# EAGLE design mm5823 (EAGLE 7.1.0)
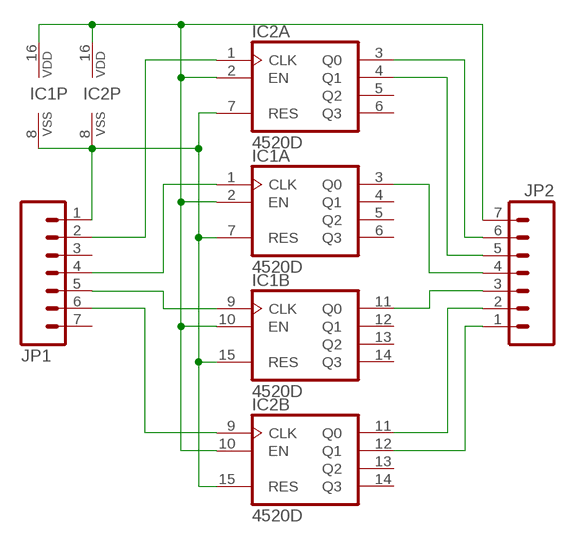
[diagram p0: schematic, sheet 1]

## Parts
IC1  4520D  [SO16]
IC2  4520D  [SO16]
JP1  M07  [1X07]
JP2  M07  [1X07]

## Nets
N$1: IC2.3(A:Q0) JP2.6
N$2: IC2.4(A:Q1) JP2.5
N$3: IC2.12(B:Q1) JP2.1
N$4: IC2.11(B:Q0) JP2.2
N$5: IC2.1(A:CLK) JP1.2
N$6: IC2.9(B:CLK) JP1.6
N$7: IC1.3(A:Q0) JP2.4
N$8: IC1.11(B:Q0) JP2.3
N$9: IC1.1(A:CLK) JP1.4
N$10: IC1.9(B:CLK) JP1.5
N$11: IC1.7(A:RES) IC1.8(P:VSS) IC1.15(B:RES) IC2.7(A:RES) IC2.8(P:VSS) IC2.15(B:RES) JP1.1
N$13: IC1.2(A:EN) IC1.10(B:EN) IC1.16(P:VDD) IC2.2(A:EN) IC2.10(B:EN) IC2.16(P:VDD) JP2.7
Unconnected: IC1.4(A:Q1) IC1.5(A:Q2) IC1.6(A:Q3) IC1.12(B:Q1) IC1.13(B:Q2) IC1.14(B:Q3) IC2.5(A:Q2) IC2.6(A:Q3) IC2.13(B:Q2) IC2.14(B:Q3) JP1.3 JP1.7

## Library data of the parts
IC1 IC2 = 45xx:4520: Dual binary up COUNTER
JP1 JP2 = SparkFun-Connectors:M07: Header 7 Standard 7-pin 0.1" header. Use with straight break away headers (SKU : PRT-00116), right angle break away headers (PRT-00553), swiss pins (PRT-00743), machine pins (PRT-00117), and female headers (PRT-00115). NOTES ON THE VARIANTS LOCK and LOCK_LONGPADS... This footprint was designed to help hold the alignment of a through-hole component (i.e. 7-pin header) while soldering it into place. You may notice that each hole has been shifted either up or down by 0.005 of an inch from it's more standard position (which is usually a perfectly straight line). This slight alteration caused the pins (the squares in the middle) to touch the edges of the holes. Because they are alternating, it causes a "brace" to hold the header in place. 0.005 has proven to be the perfect amount of "off-center" position when using our standard breakaway headers. Although looks a little odd when you look at the bare footprint, once you have a header in there, the alteration is very hard to notice. Also, if you push a header all the way into place, it is covered up entirely on the bottom side. This idea of altering the position of holes to aid alignment will be further integrated into the Sparkfun Library for other footprints. It can help hold any component with 3 or more connection pins.

## Board
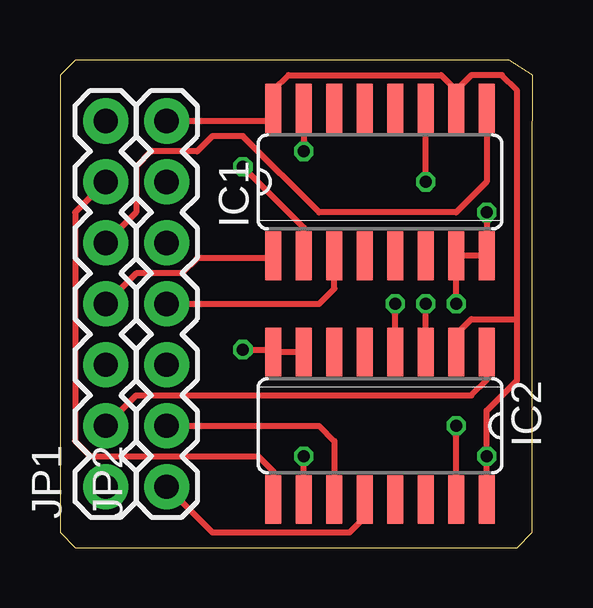
[diagram p1: board, top side]
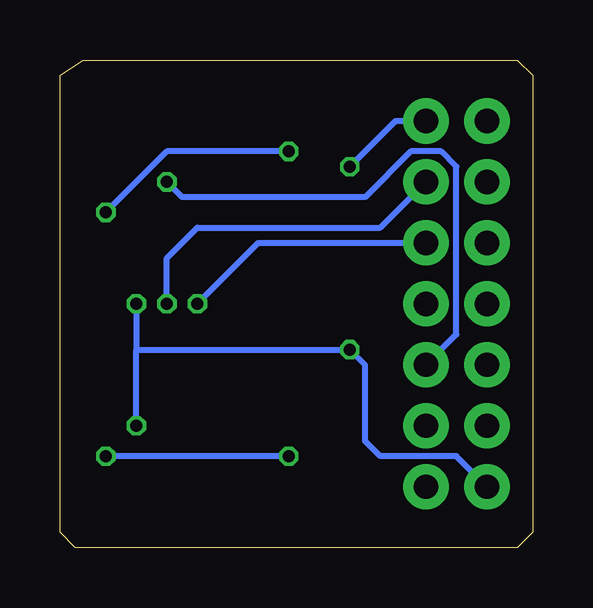
[diagram p2: board, bottom side, seen from below]

Size 19.7 x 20.32 mm. Coordinates in mm from the lower left corner, seen from the top.
Outline: 0,0.64 0.64,0 19.05,0 19.68,0.64 19.68,15.88 19.7,19.68 18.72,20.31 0.64,20.32 0,19.68 0,0.64
Copper layers (1*16): Top 0.035mm / dielectric 1.5mm / Bottom 0.035mm
Design rules "ITEADstudio_DRC": minimum track width 6mil, minimum drill 12mil, track to track 6mil, track to pad 6mil, pad to pad 6mil, via to via 6mil, smd to smd 0mil, copper to edge 10mil, drill to drill 10mil, minimum pad ring 10mil, minimum via ring 6mil, stop-mask expansion 2mil, vias tented up to drill 100mil, thermal gap 10mil

### Footprints (pad centres in the part's own frame; a part is rotated, then mirrored left to right if it is on the bottom)
SO16 = smd 0.66 x 2.032: 1 -4.445,-3.073; 2 -3.175,-3.073; 3 -1.905,-3.073; 4 -0.635,-3.073; 5 0.635,-3.073; 6 1.905,-3.073; 7 3.175,-3.073; 8 4.445,-3.073; 9 4.445,3.073; 10 3.175,3.073; 11 1.905,3.073; 12 0.635,3.073; 13 -0.635,3.073; 14 -1.905,3.073; 15 -3.175,3.073; 16 -4.445,3.073
1X07 = drill 1.016 pad 1.88: 1 0,0; 2 2.54,0; 3 5.08,0; 4 7.62,0; 5 10.16,0; 6 12.7,0; 7 15.24,0

### Placement (x,y rotation side)
IC1  13.34,15.24 0 top
IC2  13.34,5.08 180 top
JP1  1.91,2.54 90 top
JP2  4.45,2.54 90 top

### Tracks (layer width: path | path; a pad name or v marks a point on that pad's centre or on a via)
N$1  (via drill 0.5)
  Top 0.254: IC2.3 v15.24,10.16
  Bottom 0.254: v15.24,10.16 15.24,12.06 13.97,13.34 6.35,13.34 JP2.6
N$2  (via drill 0.5)
  Top 0.254: IC2.4 v13.97,10.16
  Bottom 0.254: v13.97,10.16 11.43,12.7 JP2.5
N$3
  Top 0.254: JP2.1 6.35,0.64 12.06,0.64 12.7,1.27 IC2.12
N$4
  Top 0.254: JP2.2 10.79,5.08 11.43,4.45 IC2.11
N$5
  Top 0.254: JP1.2 3.17,6.35 17.14,6.35 17.78,6.99 IC2.1
N$6
  Top 0.254: JP1.6 0.64,13.97 0.64,4.45 1.27,3.81 8.26,3.81 8.89,3.17 IC2.9
N$7
  Top 0.254: JP2.4 10.79,10.16 11.43,10.79 IC1.3
N$8  (via drill 0.5)
  Top 0.254: v15.24,15.24 IC1.11
  Bottom 0.254: JP2.3 3.17,8.89 3.17,15.88 3.81,16.51 5.08,16.51 6.99,14.61 14.61,14.61 v15.24,15.24
N$9
  Top 0.254: IC1.1 8.89,12.06 5.71,12.06 5.08,11.43 3.17,11.43 JP1.4
N$10
  Top 0.254: IC1.9 17.78,15.24 16.51,13.97 10.79,13.97 7.62,17.14 6.35,17.14 5.71,16.51 3.81,16.51 3.17,15.88 3.17,13.97 JP1.5
N$11  (via drill 0.5)
  Top 0.254: IC2.7 IC2.8 8.79,8.26 v7.62,8.26 | IC1.15 v10.16,16.51 | v17.78,13.97 IC1.8 IC1.7 v16.51,10.16 | IC2.15 v16.51,5.08
  Bottom 0.254: v10.16,16.51 15.24,16.51 v17.78,13.97 | v16.51,5.08 16.51,8.26 | JP1.1 3.17,3.81 6.35,3.81 6.99,4.45 6.99,7.62 v7.62,8.26 16.51,8.26 | v16.51,10.16 16.51,8.26
N$13  (via drill 0.5)
  Top 0.254: JP2.7 8.89,17.78 IC1.16 8.89,19.05 9.53,19.68 15.88,19.68 16.51,19.05 | 16.51,19.05 IC1.10 | IC2.16 v17.78,3.81 17.78,5.71 19.05,6.99 19.05,9.53 | 19.05,9.53 19.05,19.05 18.41,19.68 17.14,19.68 16.51,19.05 | IC2.2 16.51,8.89 17.14,9.53 19.05,9.53 | IC2.10 v10.16,3.81 | 10.16,11.43 IC1.2 10.16,13.34 v7.62,15.88
  Bottom 0.254: v10.16,3.81 v17.78,3.81 | v7.62,15.88 5.71,17.78 JP2.7